# Altium schematic sheet POWER.SchDoc
size A4
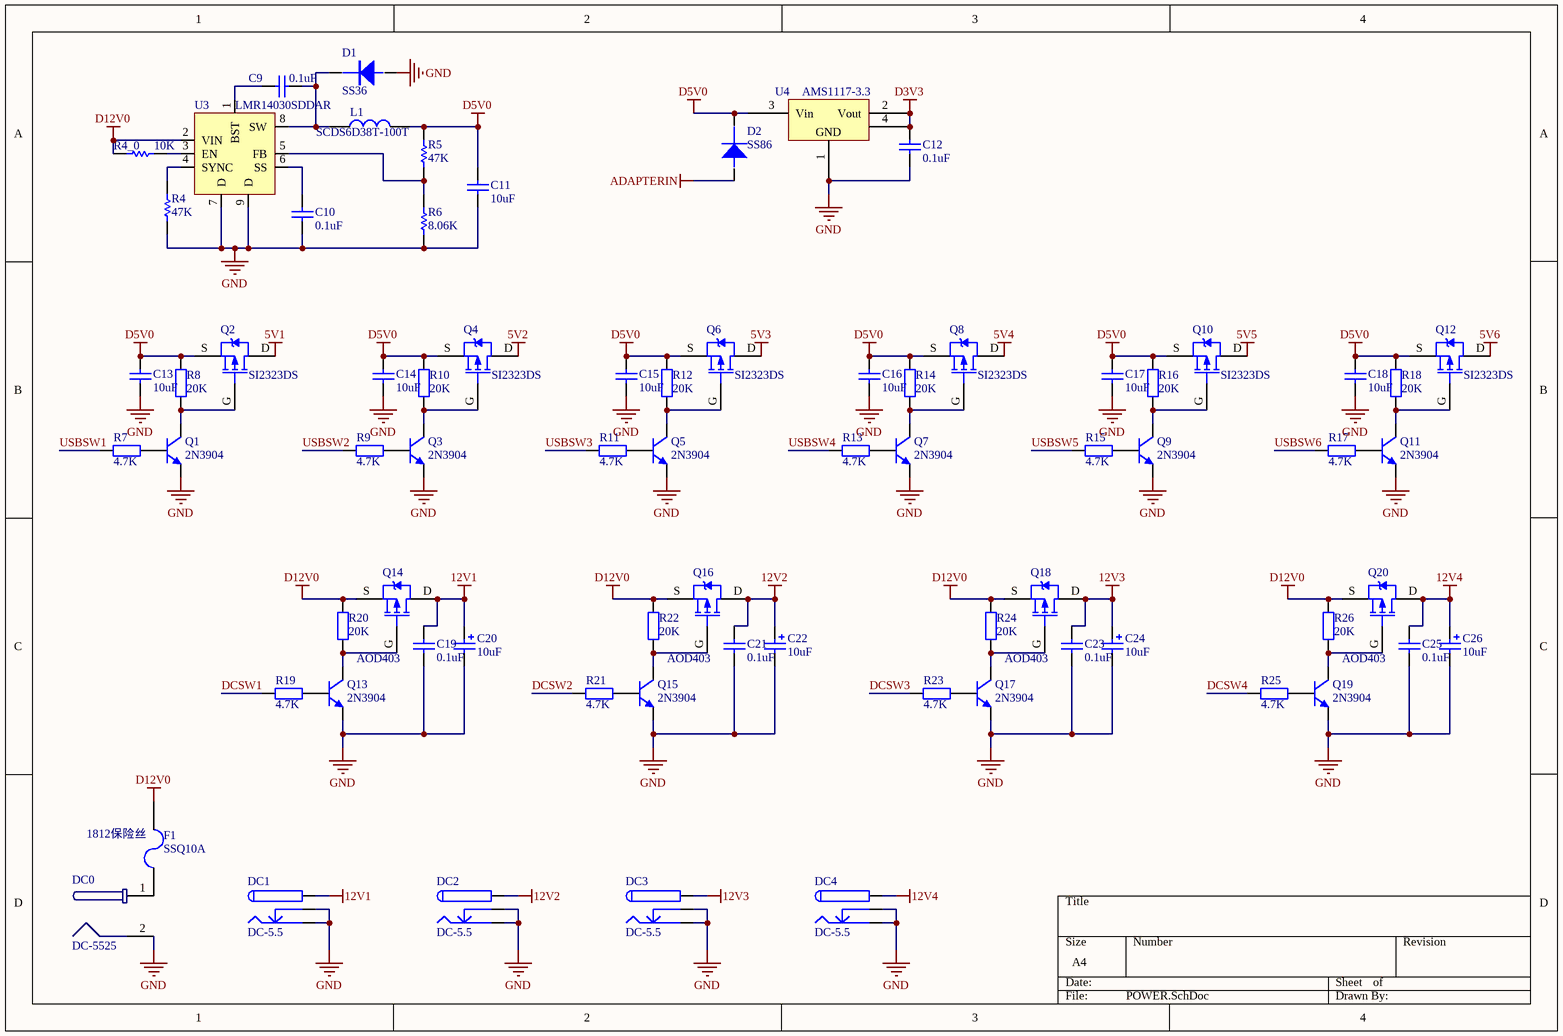
[diagram p0: POWER.SchDoc]

## Parts
C9  0.1uF  [0603C]
C10  0.1uF  [0603C]
C11  10uF  [3216]
C12  0.1uF  [0603C]
C13  10uF  [3216]
C14  10uF  [3216]
C15  10uF  [3216]
C16  10uF  [3216]
C17  10uF  [3216]
C18  10uF  [3216]
C19  0.1uF  [0603C]
C20  10uF  [3216]
C21  0.1uF  [0603C]
C22  10uF  [3216]
C23  0.1uF  [0603C]
C24  10uF  [3216]
C25  0.1uF  [0603C]
C26  10uF  [3216]
D1  SS36  [DO-214AC]
D2  SS86  [SS34]
DC0  DC-5525  [DC-5525]
DC1  DC-5.5  [DC_5.5MM]
DC2  DC-5.5  [DC_5.5MM]
DC3  DC-5.5  [DC_5.5MM]
DC4  DC-5.5  [DC_5.5MM]
F1  SSQ10A  [1812R]
L1  SCDS6D38T-100T  [CD845]
Q1  2N3904  [SOT-23]
Q2  SI2323DS  [SIMOS]
Q3  2N3904  [SOT-23]
Q4  SI2323DS  [SIMOS]
Q5  2N3904  [SOT-23]
Q6  SI2323DS  [SIMOS]
Q7  2N3904  [SOT-23]
Q8  SI2323DS  [SIMOS]
Q9  2N3904  [SOT-23]
Q10  SI2323DS  [SIMOS]
Q11  2N3904  [SOT-23]
Q12  SI2323DS  [SIMOS]
Q13  2N3904  [SOT-23]
Q14  AOD403  [TO-252]
Q15  2N3904  [SOT-23]
Q16  AOD403  [TO-252]
Q17  2N3904  [SOT-23]
Q18  AOD403  [TO-252]
Q19  2N3904  [SOT-23]
Q20  AOD403  [TO-252]
R4  47K  [0603R]
R4_0  10K  [0603R]
R5  47K  [0603R]
R6  8.06K  [0603R]
R7  4.7K  [0603R]
R8  20K  [0603R]
R9  4.7K  [0603R]
R10  20K  [0603R]
R11  4.7K  [0603R]
R12  20K  [0603R]
R13  4.7K  [0603R]
R14  20K  [0603R]
R15  4.7K  [0603R]
R16  20K  [0603R]
R17  4.7K  [0603R]
R18  20K  [0603R]
R19  4.7K  [0603R]
R20  20K  [0603R]
R21  4.7K  [0603R]
R22  20K  [0603R]
R23  4.7K  [0603R]
R24  20K  [0603R]
R25  4.7K  [0603R]
R26  20K  [0603R]
U3  LMR14030SDDAR  [LMR14030]
U4  AMS1117-3.3  [SOT223]

## Nets
5V1: Q2.D
5V2: Q4.D
5V3: Q6.D
5V4: Q8.D
5V5: Q10.D
5V6: Q12.D
12V1: C19.1 C20.1 DC1.1 Q14.D
12V2: C21.1 C22.1 DC2.1 Q16.D
12V3: C23.1 C24.1 DC3.1 Q18.D
12V4: C25.1 C26.1 DC4.1 Q20.D
ADAPTERIN: D2.1
D3V3: C12.2 U4.2(Vout) U4.4
D5V0: C11.1 C13.1 C14.1 C15.1 C16.1 C17.1 C18.1 D2.2 L1.2 Q2.S Q4.S Q6.S Q8.S Q10.S Q12.S R5.1 R8.1 R10.1 R12.1 R14.1 R16.1 R18.1 U4.3(Vin)
D12V0: F1.2 Q14.S Q16.S Q18.S Q20.S R4_0.2 R20.1 R22.1 R24.1 R26.1 U3.2(VIN)
GND: C10.1 C11.2 C12.1 C13.2 C14.2 C15.2 C16.2 C17.2 C18.2 C19.2 C20.2 C21.2 C22.2 C23.2 C24.2 C25.2 C26.2 D1.1 DC0.2 DC1.2 DC1.3 DC2.2 DC2.3 DC3.2 DC3.3 DC4.2 DC4.3 Q1.E Q3.E Q5.E Q7.E Q9.E Q11.E Q13.E Q15.E Q17.E Q19.E R4.2 R6.2 U3.7(D) U3.9(D) U4.1
DCSW1: R19.1
DCSW2: R21.1
DCSW3: R23.1
DCSW4: R25.1
USBSW1: R7.1
USBSW2: R9.1
USBSW3: R11.1
USBSW4: R13.1
USBSW5: R15.1
USBSW6: R17.1
NetC9_1: C9.1 D1.2 L1.1 U3.8(SW)
NetC9_2: C9.2 U3.1(BST)
NetC10_2: C10.2 U3.6(SS)
NetDC0_1: DC0.1 F1.1
NetQ1_B: Q1.B R7.2
NetQ1_C: Q1.C Q2.G R8.2
NetQ3_B: Q3.B R9.2
NetQ3_C: Q3.C Q4.G R10.2
NetQ5_B: Q5.B R11.2
NetQ5_C: Q5.C Q6.G R12.2
NetQ7_B: Q7.B R13.2
NetQ7_C: Q7.C Q8.G R14.2
NetQ9_B: Q9.B R15.2
NetQ9_C: Q9.C Q10.G R16.2
NetQ11_B: Q11.B R17.2
NetQ11_C: Q11.C Q12.G R18.2
NetQ13_B: Q13.B R19.2
NetQ13_C: Q13.C Q14.G R20.2
NetQ15_B: Q15.B R21.2
NetQ15_C: Q15.C Q16.G R22.2
NetQ17_B: Q17.B R23.2
NetQ17_C: Q17.C Q18.G R24.2
NetQ19_B: Q19.B R25.2
NetQ19_C: Q19.C Q20.G R26.2
NetR4_0_1: R4_0.1 U3.3(EN)
NetR4_1: R4.1 U3.4(SYNC)
NetR5_2: R5.2 R6.1 U3.5(FB)

## Notes on the sheet
- (near F1) 1812保险丝
- (in symbol SPX1117) GND

## Library data of the parts
C9-C19 C21 C23 C25 = Cap: Capacitor; Published: 8-Jun-2000; LatestRevisionDate: 17-Jul-2002; LatestRevisionNote: Re-released for DXP Platform.; PackageReference: RAD-0.3; Publisher: Altium Limited
  C9 C10 C12 C19 C21 C23 C25: Value: 0.1uF
  C11 C13-C18: Value: 10uF
C20 C22 C24 C26 = Cap Pol1: Polarized Capacitor (Radial); Published: 8-Jun-2000; LatestRevisionDate: 17-Jul-2002; LatestRevisionNote: Re-released for DXP Platform.; PackageReference: RB7.6-15; Publisher: Altium Limited; Value: 10uF
D1 = SS36: 二极管，3A
D2 = SS86: Diode,Vr=60V,If=8.0A,Vf=0.75V,DO-214AB,SS86,8.13x6.22x2.62mm; Manufacture 1: GS; Hight: 2.62mm; Part Type: Diode; Manufacture 1 P/N: SS86; Value: SS86
DC1-DC4 = POWER-5.5
F1 = FUSE2: Fuse
L1 = SPM6530: 电感
Q1 Q3 Q5 Q7 Q9 Q11 Q13 Q15 Q17 Q19 = 2N3904: NPN General Purpose Amplifier; Published: 8-Jun-2000; LatestRevisionDate: 15-Jan-2003; LatestRevisionNote: PCB Footprint 'BCY-W3/D4.7' replaced; DatasheetVersion: 1997; PackageVersion: Sep-1998; PackageReference: TO-92A; Publisher: Altium Limited; Code_JEDEC: TO-92A; ComponentLink1Description: Manufacturer Link; ComponentLink1URL: http://www.fairchildsemi.com/; ComponentLink2Description: Datasheet; ComponentLink2URL: http://www.fairchildsemi.com/ds/2N%2F2N3904.pdf
Q2 Q4 Q6 Q8 Q10 Q12 Q14 Q16 Q18 Q20 = SI2323
R4 R4_0 R5 R6 = Res: 贴片电阻; Published: 8-Jun-2000; LatestRevisionDate: 17-Jul-2002; LatestRevisionNote: Re-released for DXP Platform.; PackageReference: AXIAL-0.3; Publisher: Altium Limited
  R4 R5: Value: 47K
  R4_0: Value: 10K
  R6: Value: 8.06K
R7-R26 = RES: Resistor; Published: 8-Jun-2000; Revision: July-2002: Re-released for DXP Platform.; Publisher: Altium Limited
  R7 R9 R11 R13 R15 R17 R19 R21 R23 R25: Value: 4.7K
  R8 R10 R12 R14 R16 R18 R20 R22 R24 R26: Value: 20K
U3 = LMR14030
U4 = SPX1117